# Altium schematic sheet Micro.SchDoc
size A4
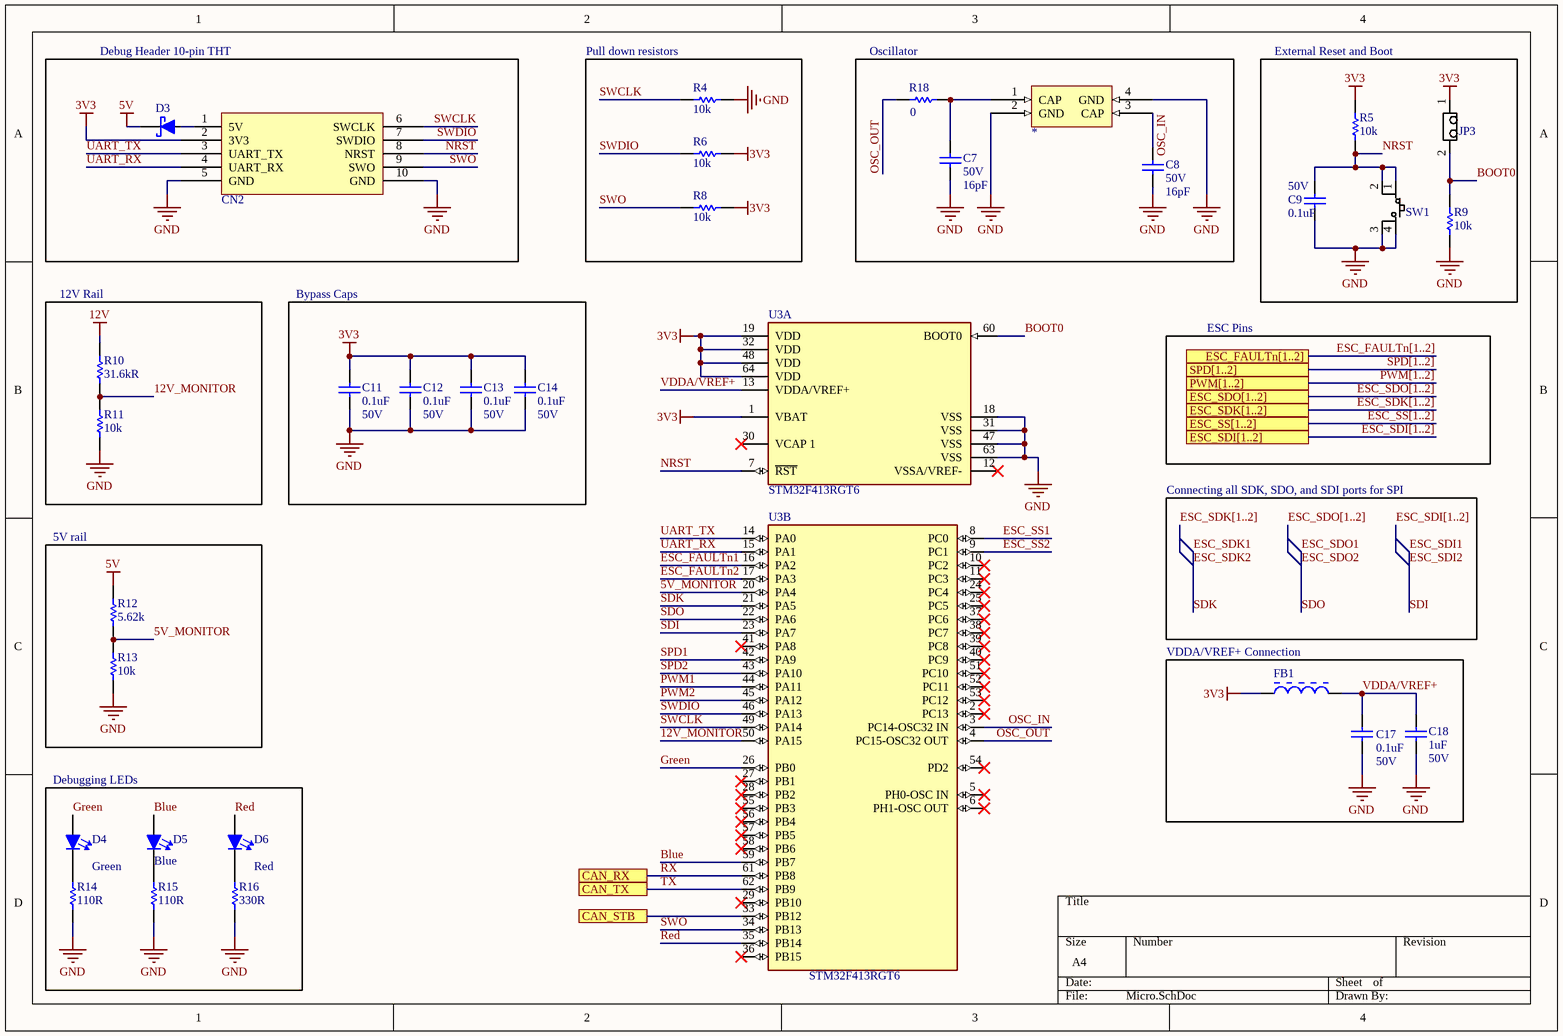
[diagram p0: Micro.SchDoc]

## Parts
*  CRYSTAL 8.0MHZ 16PF SMD  [QFN250P750X520X140_HS-5M]  (value not drawn)
C7  Voltage: 50V  Capacitance: 16pF  [CAPC1608X90X35LL10T15]  (hidden comment: 16pF Ceramic 50V 5% 0603)
C8  Voltage: 50V  Capacitance: 16pF  [CAPC1608X90X35LL10T15]  (hidden comment: 16pF Ceramic 50V 5% 0603)
C9  Voltage: 50V  Capacitance: 0.1uF  [FP-CL10-0_1-MFG]  (hidden comment: CL10B104JB8NNNC)
C11  Capacitance: 0.1uF  Voltage: 50V  [FP-CL10-0_1-IPC_A]  (hidden comment: CL10B104JB8NNNC)
C12  Capacitance: 0.1uF  Voltage: 50V  [FP-CL10-0_1-IPC_A]  (hidden comment: CL10B104JB8NNNC)
C13  Capacitance: 0.1uF  Voltage: 50V  [FP-CL10-0_1-IPC_A]  (hidden comment: CL10B104JB8NNNC)
C14  Capacitance: 0.1uF  Voltage: 50V  [FP-CL10-0_1-IPC_A]  (hidden comment: CL10B104JB8NNNC)
C17  Voltage: 50V  Capacitance: 0.1uF  [FP-CL10-0_1-MFG]  (hidden comment: CL10B104JB8NNNC)
C18  Capacitance: 1uF  Voltage: 50V  [0803 CAP]  (hidden comment: CL21B105KBFNNNG)
CN2  ST Debug Header 10-pin THT  [10-pin shrouded header THT]  (value not drawn)
D3  CUS08F30,H3F  [SC-76]  (value not drawn)
D4  Color: Green  [FP-LB_Q39E-MFG]  (hidden comment: LT Q39G-Q1OO-25-1)
D5  Color: Blue  [FP-LB_Q39E-MFG]  (hidden comment: LBQ39E-N1OO-35-1)
D6  Color: Red  [FP-LB_Q39E-MFG]  (hidden comment: LSQ976-NR-1)
FB1  BLM18AG601SN1D  [MURA-BLM18-F-H1-CHIP-2_V]  (value not drawn)
JP3  1x2 Male Header  [2X1 Males Header]  (value not drawn)
R4  value 10k  [RESC1608N(0603")]  (hidden comment: 10kR, 1%, 1/10W, 0603 SMD)
R5  value 10k  [RESC1608N(0603")]  (hidden comment: 10kR, 1%, 1/10W, 0603 SMD)
R6  value 10k  [RESC1608N(0603")]  (hidden comment: 10kR, 1%, 1/10W, 0603 SMD)
R8  value 10k  [RESC1608N(0603")]  (hidden comment: 10kR, 1%, 1/10W, 0603 SMD)
R9  value 10k  [RESC1608N(0603")]  (hidden comment: 10kR, 1%, 1/10W, 0603 SMD)
R10  value 31.6kR  [RESC1608N(0603")]  (hidden comment: 31.6kR, 1%, 1/10W, 0603, SMD)
R11  value 10k  [RESC1608N(0603")]  (hidden comment: 10kR, 1%, 1/10W, 0603 SMD)
R12  value 5.62k  [RESC1608N(0603")]  (hidden comment: 5.62kR, 1%, 1/10W , 0603, SMD)
R13  value 10k  [RESC1608N(0603")]  (hidden comment: 10kR, 1%, 1/10W, 0603 SMD)
R14  Resistance: 110R  [RESC1608X55X25ML10T15]  (hidden comment: RC0603FR-07110RL)
R15  Resistance: 110R  [RESC1608X55X25ML10T15]  (hidden comment: RC0603FR-07110RL)
R16  Resistance: 330R  [FP-CRCW0603-e3-IPC_C]  (hidden comment: CRCW0603330RFKEA)
R18  value 0  [RESC1608N(0603")]  (hidden comment: 10kR, 1%, 1/10W, 0603 SMD)
SW1  PTS645SL43SMTR92LFS  [4-SPST-NO]  (value not drawn)
U3  STM32F413RGT6  [FP-LQFP64-5W-IPC_A]  (parts A,B of 2)

## Blocks framed on the sheet
Debug Header 10-pin THT: CN2 D3
Pull down resistors: R4 R6 R8
Oscillator: * C7 C8 R18
External Reset and Boot: C9 JP3 R5 R9 SW1
12V Rail: R10 R11
Bypass Caps: C11-C14
5V rail: R12 R13
VDDA/VREF+ Connection: C17 C18 FB1
Debugging LEDs: D4-D6 R14-R16

## Ports
CAN_RX, CAN_STB, CAN_TX, ESC_FAULTn[1..2], ESC_SDI[1..2], ESC_SDK[1..2], ESC_SDO[1..2], ESC_SS[1..2], PWM[1..2], SPD[1..2]

## Nets
3V3: C11.2 C12.2 C13.2 C14.2 CN2.2(3V3) FB1.1 JP3.1 R5.2 R6.2 R8.2 U3.1(VBAT) U3.19(VDD) U3.32(VDD) U3.48(VDD) U3.64(VDD)
5V: D3.K(Cathode) R12.2
12V: R10.2
GND: *.2(GND) *.4(GND) C7.1 C8.1 C9.1 C11.1 C12.1 C13.1 C14.1 C17.2 C18.1 CN2.5(GND) CN2.10(GND) R4.2 R9.1 R11.1 R13.1 R14.1 R15.1 R16.1 SW1.3 SW1.4 U3.18(VSS) U3.31(VSS) U3.47(VSS) U3.63(VSS)
5V_MONITOR: R12.1 R13.2 U3.20(PA4)
12V_MONITOR: R10.1 R11.2 U3.50(PA15)
Blue: D5.2(Anode) U3.59(PB7)
BOOT0: JP3.2 R9.2 U3.60(BOOT0)
CAN_STB: U3.33(PB12) ; port CAN_STB
ESC_FAULTn1: U3.16(PA2)
ESC_FAULTn2: U3.17(PA3)
ESC_SDI1: U3.23(PA7)  [also labelled ESC_SDI2, SDI]
ESC_SDK1: U3.21(PA5)  [also labelled ESC_SDK2, SDK]
ESC_SDO1: U3.22(PA6)  [also labelled ESC_SDO2, SDO]
ESC_SS1: U3.8(PC0)
ESC_SS2: U3.9(PC1)
Green: D4.2(Anode) U3.26(PB0)
NRST: C9.2 CN2.8(NRST) R5.1 SW1.1 SW1.2 U3.7(~{RST})
OSC_IN: *.3(CAP) C8.2 U3.3(PC14-OSC32_IN)
OSC_OUT: R18.1 U3.4(PC15-OSC32_OUT)
PWM1: U3.44(PA11)
PWM2: U3.45(PA12)
Red: D6.2(Anode) U3.35(PB14)
RX: U3.61(PB8) ; port CAN_RX
SPD1: U3.42(PA9)
SPD2: U3.43(PA10)
SWCLK: CN2.6(SWCLK) R4.1 U3.49(PA14)
SWDIO: CN2.7(SWDIO) R6.1 U3.46(PA13)
SWO: CN2.9(SWO) R8.1 U3.34(PB13)
TX: U3.62(PB9) ; port CAN_TX
UART_RX: CN2.4(UART_RX) U3.15(PA1)
UART_TX: CN2.3(UART_TX) U3.14(PA0)
VDDA/VREF+: C17.1 C18.2 FB1.2 U3.13(VDDA/VREF+)
Net*_1: *.1(CAP) C7.2 R18.2
NetCN2_1: CN2.1(5V) D3.A(Anode)
NetD4_1: D4.1(Cathode) R14.2
NetD5_1: D5.1(Cathode) R15.2
NetD6_1: D6.1(Cathode) R16.2

Not connected (* = marked no-connect by the designer): U3 2(PC13)* 5(PH0-OSC_IN)* 6(PH1-OSC_OUT)* 10(PC2)* 11(PC3)* 12(VSSA/VREF-)* 24(PC4)* 25(PC5)* 27(PB1)* 28(PB2)* 29(PB10)* 30(VCAP_1)* 36(PB15)* 37(PC6)* 38(PC7)* 39(PC8)* 40(PC9)* 41(PA8)* 51(PC10)* 52(PC11)* 53(PC12)* 54(PD2)* 55(PB3)* 56(PB4)* 57(PB5)* 58(PB6)*

## Buses and harness runs
bus ESC_FAULTn[1..2] = port ESC_FAULTn[1..2]
bus ESC_SDI[1..2]
bus ESC_SDI[1..2] = port ESC_SDI[1..2]
bus ESC_SDK[1..2]
bus ESC_SDK[1..2] = port ESC_SDK[1..2]
bus ESC_SDO[1..2]
bus ESC_SDO[1..2] = port ESC_SDO[1..2]
bus ESC_SS[1..2] = port ESC_SS[1..2]
bus PWM[1..2] = port PWM[1..2]
bus SPD[1..2] = port SPD[1..2]

## Notes on the sheet
- ESC Pins
- Connecting all SDK, SDO, and SDI ports for SPI

## Library data of the parts
* = CMP-00079-3: 8MHz ±30ppm Crystal 16pF 80 Ohms 4-SMD, No Lead; ESR (Equivalent Series Resistance): 80R; Frequency Stability: 50ppm; Case/Package: CSMD; Load Capacitance: 16pF; Number of Pins: 4; Min Operating Temperature: -20°C; Depth: 5.2mm; Max Operating Temperature: 70°C; Length: 7.5mm; Packaging: Tape and Reel; Frequency: 8MHz
C7 C8 = CMP-00087-2: Cap Ceramic 16pF 50V C0G 5% SMD 0603 125C Paper T/R; Temperature Coefficient: 30ppm/°C; Termination: SMD/SMT; Voltage Rating: 50V; Dielectric: C0G; Radiation Hardening: No; Voltage Rating (DC): 50V; Max Operating Temperature: 125°C; Height: 0.8mm; Width: 0.8mm; Length: 1.6mm; Package Quantity: 1; Lead Free: Lead Free; Min Operating Temperature: -55°C; Case Code (Metric): 1608; Case/Package: 0603; Tolerance: 5%; Mount: Surface Mount; Thickness: 0.035inch; Case Code (Imperial): 0603; Depth: 0.8mm; Packaging: Tape and Reel
C9 C17 = CMP-00000-3: CAP CER 0.1UF 50V X7R 0603; Tolerance: 5%; Material: Ceramic; Case Code (Imperial): 0603; Mount: Surface Mount; Thickness: 0.035inch; Depth: 0.8mm; Packaging: Tape and Reel; Package Quantity: 1; Dielectric: X7R; Height: 0.8mm; Radiation Hardening: No; Max Operating Temperature: 125°C; Voltage Rating: 50V; Case/Package: 0603; Min Operating Temperature: -55°C; Case Code (Metric): 1608; Length: 1.6mm; Contact Plating: Tin; Width: 0.031inch
C11-C14 = CMP-00000-4: CAP CER 0.1UF 50V X7R 0603; Tolerance: 5%; Material: Ceramic; Packaging: Tape and Reel; Max Operating Temperature: 125°C; Mount: Surface Mount; Voltage Rating: 50V; Package Quantity: 1; Radiation Hardening: No; Depth: 0.8mm; Case Code (Metric): 1608; Case Code (Imperial): 0603; Case/Package: 0603; Width: 0.031inch; Contact Plating: Tin; Length: 1.6mm; Dielectric: X7R; Min Operating Temperature: -55°C; Height: 0.8mm; Thickness: 0.035inch
C18 = CMP-00005-3: SAMSUNG ELECTRO-MECHANICS - CL21B105KBFNNNG - MLCC CAPACITORS; Dielectric: X7R; Tolerance: 10%; Material: Ceramic; Min Operating Temperature: -55°C; Length: 2mm; Termination: Wraparound; Contact Plating: Tin; Package Quantity: 3000; Mount: Surface Mount; Max Operating Temperature: 125°C; Case Code (Imperial): 0805; Thickness: 0.053inch; Case/Package: 0805; Width: 0.049inch; Voltage Rating: 50V; Depth: 1.25mm; Packaging: Tape and Reel; Case Code (Metric): 2012
CN2 = CMP-00011-6: CONN HEADER VERT 10POS 2.54MM; Number of Positions: 10; Connector Type: Male Pin; Pitch: 0.1inch; Mount: Through Hole; Lead Free: Lead Free; Packaging: Tray; Termination: Solder; Package Quantity: 1; Color: Black; Contact Plating: Gold; Number of Rows: 2; Row Spacing: 0.1inch
D3 = CMP-057-0000-2: Diode Schottky 30V 800mA Surface Mount USC; Peak Non-Repetitive Surge Current: 5A; Element Configuration: Single; Peak Reverse Current: 50uA; Packaging: Tape and Reel; Mount: Surface Mount; Average Rectified Current: 800mA; Case/Package: SOD; Max Reverse Voltage (DC): 30V; Min Operating Temperature: -55°C; Contact Plating: Tin,Silver; Max Repetitive Reverse Voltage (Vrrm): 30V; Number of Pins: 2; Max Operating Temperature: 125°C
D4 = CMP-00064-3: LED GREEN DIFFUSED 0603 SMD; Dominant Wavelength: 530nm; Luminous Intensity: 280mcd; Lens Style: Diffused,Colorless,Rectangular; Number of LEDs: 1; Forward Voltage: 2.85V; Test Current: 5mA; Reverse Voltage: 5V; Forward Current: 15mA; Luminous Flux: 0.55lm; Radiation Hardening: No; Packaging: Tape and Reel; Mount: Surface Mount; Max Operating Temperature: 85°C; Number of Elements: 1; Number of Pins: 2; Min Operating Temperature: -40°C; Depth: 0.9mm; Case/Package: SMD/SMT; Length: 1.7mm
D5 = CMP-00063-3: LED BLUE DIFFUSED 0603 SMD; Luminous Flux: 0.13lm; Lens Size: 0.8mm; Lens Color: White; Viewing Angle: 130°; Luminous Intensity: 42mcd; Number of LEDs: 1; Dominant Wavelength: 470nm; Lens Style: Flat,Diffused,Colorless,Rectangular; Test Current: 5mA; Forward Voltage: 2.85V; Packaging: Tape and Reel; Case/Package: 0603; Height: 0.4mm; Number of Pins: 2; Mount: Surface Mount; Case Code (Metric): 1608; Case Code (Imperial): 0603; Lens Transparency: Diffused; Width: 0.8mm; Length: 1.6mm; Radiation Hardening: No
D6 = CMP-00066-2: LED Red 645nm 2-Pin Chip 0603(1608Metric) T/R; Lens Transparency: Diffused; Power Dissipation: 65mW; Forward Voltage: 2.5V; Dominant Wavelength: 633nm; Number of Elements: 1; Lens Style: Diffused,Flat,Colorless,Rectangular; Lens Color: White; Viewing Angle: 160°; Luminous Flux: 0.33lm; Test Current: 20mA; Forward Current: 25mA; Luminous Intensity: 180mcd; Reverse Voltage: 12V; Lens Size: 0.8mm; Max Operating Temperature: 85°C; Depth: 0.9mm; Illumination Color: Red; Packaging: Tape and Reel; Min Operating Temperature: -30°C; Case Code (Imperial): 0603; Case Code (Metric): 1608; Number of Pins: 2; Mount: Surface Mount; Height: 0.8mm; Package Quantity: 1; Length: 1.7mm; Width: 0.8mm; Number of LEDs: 1; Case/Package: 0603; Radiation Hardening: No
FB1 = CMP-00016-1: MURATA - BLM18AG601SN1D - Feritový Korálek, 0603 / 1608, 600 ohm, 500 mA, Série BLM18A, 0.38 ohm, ± 25%; DC Current: 500mA; Impedance: 600R; DC Resistance (DCR): 380mR; Core Material: Ferrite; Shielding: Unshielded; Number of Lines: 1; Test Frequency: 100MHz; Material: Steel,Ferrite; Height: 0.8mm; Depth: 0.8mm; Min Operating Temperature: -55°C; Packaging: Tape and Reel; Weight: 7.1E-05oz; Width: 0.8mm; Military Standard: Not; Max Operating Temperature: 125°C; Max Current Rating: 500mA; Case Code (Metric): 1608; Length: 1.6mm; Case Code (Imperial): 0603; Package Quantity: 1; Max DC Current: 500mA; REACH SVHC: No SVHC; Termination: SMD/SMT; Current Rating: 500mA; Lead Free: Lead Free; Tolerance: 25%; Case/Package: 0603; Number of Pins: 2; Radiation Hardening: No; Frequency: 100MHz; Number of Circuits: 1
JP3 = CMP-004-0001-1: Made By: Andy Bates; Source: AUVic_Schematic_Library_Connectors.SchLib; Pin Count: 2; Design Item ID: 1x2 Male Header; Component Type: Standard
R4-R6 R8 R9 R11 R13 R18 = CMP-047-0013-1: Owned By: AUVic; Made By: Ashwin Sira; Design Item ID: 10kR, 1%, 1/10W, 0603 SMD; Pin Count: 2; Component Type: Standard; Created On: 14-05-31; Last Edited: 14-05-31; Source: AUVic_Schematic_Library_Resistors.SchLib
R10 = CMP-047-0042-1: Source: AUVic_Schematic_Library_Resistors.SchLib; Component Type: Standard; Design Item ID: 31.6kR, 1%, 1/10W, 0603, SMD; ComponentLink1Description: Digikey; Created By: Robert Keen; Date Created: 2018-07-18; ComponentLink1URL: https://www.digikey.ca/product-detail/en/stackpole-electronics-inc/RMCF0603FT31K6/RMCF0603FT31K6CT-ND/1943089; Pin Count: 2
R12 = CMP-047-0057-1: Publisher: AUVic; Design Item ID: 5.62kR, 1%, 1/10W , 0603, SMD; Source: AUVic_Schematic_Library_Resistors.SchLib; Date Created: 2016-06-29; Pin Count: 2; Created By: Andy Bates; Component Type: Standard
R14 R15 = CMP-00069-1: RES SMD 110 OHM 1% 1/10W 0603; Max Power Dissipation: 100mW; Voltage Rating (DC): 50V; Temperature Coefficient: 100ppm/°C; Working Voltage: 75V; Military Standard: Not; Termination: SMD/SMT; Number of Terminations: 2; Features: Moisture Resistant; Min Operating Temperature: -55°C; Power Rating: 100mW; Height: 0.022inch; Package Quantity: 1; Lead Free: Lead Free; Tolerance: 1%; Voltage Rating: 50V; Composition: Thick Film; Case Code (Imperial): 0603; Length: 1.6mm; Packaging: Tape and Reel; Case Code (Metric): 1608; Max Operating Temperature: 155°C; Depth: 0.8mm; Case/Package: 0603; Width: 0.031inch
R16 = CMP-00067-2: Res Thick Film 0603 330 Ohm 1% 0.1W(1/10W) +/-100ppm/ßC Pad SMD Automotive T/R; Voltage Rating (DC): 75V; Power Rating: 100mW; Temperature Coefficient: 100ppm/°C; Contact Plating: Tin; Package Quantity: 10; Tolerance: 1%; Packaging: Tape and Reel; Case/Package: 0603; Max Operating Temperature: 155°C; Case Code (Metric): 1608; Case Code (Imperial): 0603; Min Operating Temperature: -55°C; Length: 1.55mm; Height: 0.45mm; Lead Free: Lead Free; Termination: SMD/SMT; Voltage Rating: 75V; Composition: Thick Film; Weight: 7.1E-05oz; Military Standard: Not; Max Power Dissipation: 100mW; REACH SVHC: Unknown; Mount: Surface Mount; Depth: 0.85mm; Features: Automotive AEC-Q200; Number of Terminations: 2; Radiation Hardening: No; Width: 0.033inch
SW1 = CMP-00077-1: Black Switch Tactile N.O. SPST Round Button Gull Wing 0.05A 12VDC 100000Cycles 1.27N SMD T/R; Actuator Type: Standard; Current Rating: 50mA; Switch Function: Off-Mom; Actuator Length: 0.85mm; Contact Resistance: 100mR; Max Voltage Rating (DC): 12V; Actuator Material: Nylon,Polyamide; Illumination Type: Non-Illuminated; Orientation: Straight; Mechanical Life: 100000Cycles; Package Quantity: 1000; Operating Force: 1.27N; Color: Black; Button Colour: Black; Max Operating Temperature: 60°C; Length: 6mm; Contact Plating: Silver; Termination: Gull Wing; Min Operating Temperature: -20°C; Mount: Surface Mount; Voltage Rating (DC): 12V; Max Current Rating: 50mA; Lead Free: Lead Free; Depth: 9mm; Packaging: Tape and Reel; Throw Configuration: SPST; Contact Material: Bronze,Brass,Silver
U3 = CMP-00006-2: STMICROELECTRONICS - STM32F413RGT6 - MCU, ARM CORTEX-M4, 100MHZ, LQFP-64; Peripherals: Brown-out Detect/Reset,POR,PWM,WDT,DMA,LCD; Memory Type: FLASH; Oscillator Type: Internal; Interface: I2C,SPI,USB,IrDA,MMC,SDIO,UART,USART; Number of I/Os: 50; Memory Size: 1MB; Case/Package: LQFP; Max Operating Temperature: 85°C; Frequency: 100MHz; Core Architecture: ARM; Min Operating Temperature: -40°C; Packaging: Tray